# Altium schematic sheet v1.3.SchDoc
size 127 x 83 mm
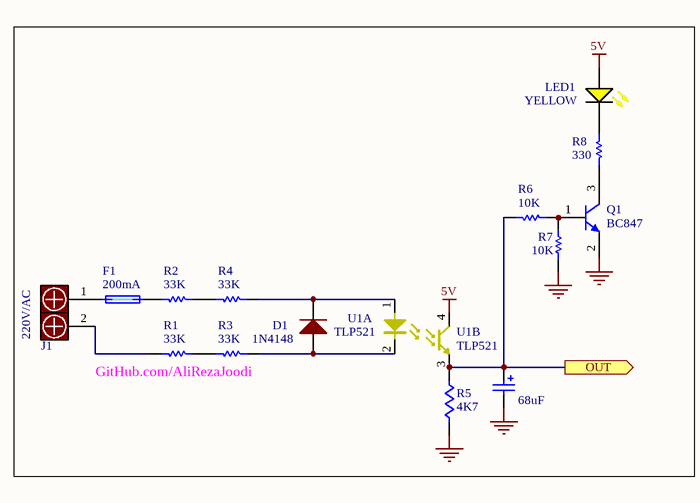
[diagram p0: v1.3.SchDoc]

## Parts
C1  value 68uF  [Cap_D]  (hidden comment: CAP)
D1  1N4148  [SMD_DO-213AA]
F1  200mA  [SMD_1206]
J1  Connector1x2_Power_4Form  [1x2_P8.26]  (value not drawn)
LED1  YELLOW  [SMD_0805_YELLOW]
Q1  BC847  [SOT23-3N]
R1  33K
R2  33K
R3  33K
R4  33K
R5  4K7  [0805]
R6  10K
R7  10K
R8  330
U1  TLP521  [DIP_4]  (parts A,B of 2)

## Ports
OUT (out)

## Nets
5V: LED1.1(A) U1.4(C)
GND: C1.2 Q1.2(E) R5.2 R7.1
OUT: C1.1 R5.1 R6.1 U1.3(E) ; port OUT
NetD1_1: D1.1(A) R3.1 U1.2(K)
NetD1_2: D1.2(K) R4.1 U1.1(A)
NetF1_1: F1.1 J1.1
NetF1_2: F1.2 R2.2
NetJ1_2: J1.2 R1.2
NetLED1_2: LED1.2(K) R8.2
NetQ1_1: Q1.1(B) R6.2 R7.2
NetQ1_3: Q1.3(C) R8.1
NetR1_1: R1.1 R3.2
NetR2_1: R2.1 R4.2

## Notes on the sheet
- (near J1) 220V/AC
- GitHub.com/AliRezaJoodi

## Library data of the parts
C1 = Cap Pol1: Polarized Capacitor (Radial); Manufacturer: Generic Components; Class I: Passive; Published: 8-Jun-2000; Revision: July-2002: Re-released for DXP Platform.; Publisher: Altium Limited; Class II: Capacitor
D1 = Diode_2Form: Diode; 1_Manufacturer: Microchip Technology; 1_Part Number: 1N4148UR-1; 1_Link: https://eu.mouser.com/ProductDetail/Microchip-Technology/1N4148UR-1?qs=%252BRKXB2WKlSdXiNZTe6I9fg%3D%3D
F1 = Fuse: 1_Part Number: 0437.250WRA; 1_Manufacturer: Littelfuse; 1_Link: https://eu.mouser.com/ProductDetail/Littelfuse/0437.250WRA?qs=sPbYRqrBIVmaapF4EZvohQ%3D%3D
J1 = Connector1x2_Power_4Form: Connector, Barrier Terminal Blocks, 2Pin; 1_Manufacturer: TE Connectivity; 1_Part Number: 1977477-2; 1_Link: https://eu.mouser.com/ProductDetail/TE-Connectivity/1977477-2?qs=94mdU9cNTDpZiO77z39FFw%3D%3D
LED1 = LED_YELLOW: LED; Revision: July-2002: Re-released for DXP Platform.
Q1 = BC847: Silicon Bipolar Transistor
R1-R4 R6-R8 = Resistor: Resistor, 1/4W, 5%; Revision: July-2002: Re-released for DXP Platform.
R5 = Res1: Resistor; Manufacturer: Generic Components; Class I: Passive; Published: 8-Jun-2000; Revision: July-2002: Re-released for DXP Platform.; Publisher: Altium Limited; Class II: Resistor
U1 = TLP521: Phototransistor; Publisher: Altium Limited